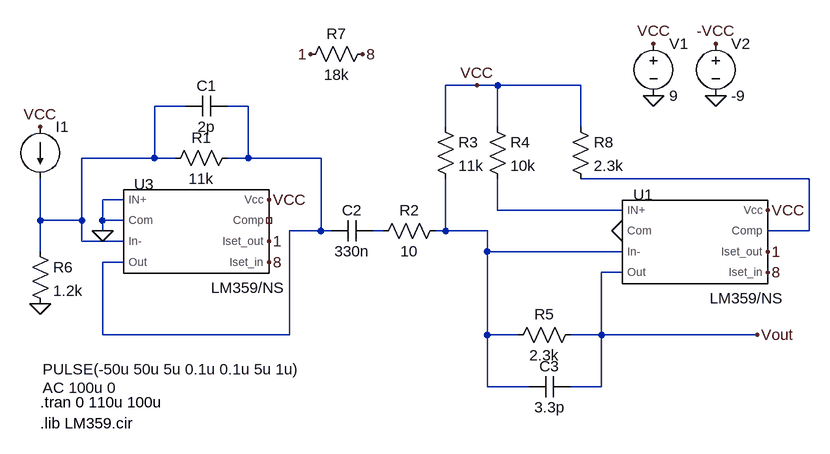
[diagram p0: schematic RX.asc]
RX.asc, the LTspice schematic file:
Version 4
SHEET 1 1124 680
WIRE 432 -128 384 -128
WIRE 464 -128 432 -128
WIRE 592 -128 464 -128
WIRE -16 -96 -64 -96
WIRE 80 -96 48 -96
WIRE 384 -64 384 -128
WIRE 464 -64 464 -128
WIRE 592 -64 592 -128
WIRE -64 -16 -64 -96
WIRE -64 -16 -176 -16
WIRE -32 -16 -64 -16
WIRE 80 -16 80 -96
WIRE 80 -16 48 -16
WIRE 192 -16 80 -16
WIRE 944 16 592 16
WIRE -112 48 -144 48
WIRE 464 64 464 16
WIRE 656 64 464 64
WIRE -240 80 -240 16
WIRE -176 80 -176 -16
WIRE -176 80 -240 80
WIRE -144 80 -144 48
WIRE -112 80 -144 80
WIRE -144 96 -144 80
WIRE 192 96 192 -16
WIRE 192 96 144 96
WIRE 208 96 192 96
WIRE 288 96 272 96
WIRE 384 96 384 16
WIRE 384 96 368 96
WIRE 448 96 384 96
WIRE 944 96 944 16
WIRE 944 96 880 96
WIRE -176 112 -176 80
WIRE -112 112 -176 112
WIRE -240 128 -240 80
WIRE 448 128 448 96
WIRE 656 128 448 128
WIRE -112 144 -144 144
WIRE 656 160 624 160
WIRE -144 256 -144 144
WIRE 144 256 144 96
WIRE 144 256 -144 256
WIRE 448 256 448 128
WIRE 496 256 448 256
WIRE 624 256 624 160
WIRE 624 256 576 256
WIRE 864 256 624 256
WIRE 448 336 448 256
WIRE 512 336 448 336
WIRE 624 336 624 256
WIRE 624 336 576 336
FLAG -240 208 0
FLAG -144 96 0
FLAG 704 -112 0
FLAG 800 -112 0
FLAG 704 -192 VCC
FLAG 800 -192 -VCC
FLAG 432 -128 VCC
FLAG -240 -64 VCC
FLAG 176 -176 1
FLAG 256 -176 8
FLAG 112 112 1
FLAG 112 144 8
FLAG 112 48 VCC
FLAG 880 64 VCC
FLAG 880 128 1
FLAG 880 160 8
FLAG 656 96 0
FLAG 864 256 Vout
SYMBOL res 64 -32 R90
WINDOW 0 0 56 VBottom 2
WINDOW 3 32 56 VTop 2
SYMATTR InstName R1
SYMATTR Value 11k
SYMBOL cap 48 -112 R90
WINDOW 0 0 32 VBottom 2
WINDOW 3 32 32 VTop 2
SYMATTR InstName C1
SYMATTR Value 2p
SYMBOL cap 272 80 R90
WINDOW 0 0 32 VBottom 2
WINDOW 3 32 32 VTop 2
SYMATTR InstName C2
SYMATTR Value 330n
SYMBOL res 384 80 R90
WINDOW 0 0 56 VBottom 2
WINDOW 3 32 56 VTop 2
SYMATTR InstName R2
SYMATTR Value 10
SYMBOL res 368 -80 R0
SYMATTR InstName R3
SYMATTR Value 11k
SYMBOL res 448 -80 R0
SYMATTR InstName R4
SYMATTR Value 10k
SYMBOL res 592 240 R90
WINDOW 0 0 56 VBottom 2
WINDOW 3 32 56 VTop 2
SYMATTR InstName R5
SYMATTR Value 2.3k
SYMBOL cap 576 320 R90
WINDOW 0 0 32 VBottom 2
WINDOW 3 32 32 VTop 2
SYMATTR InstName C3
SYMATTR Value 3.3p
SYMBOL res -256 112 R0
SYMATTR InstName R6
SYMATTR Value 1.2k
SYMBOL voltage 704 -208 R0
SYMATTR InstName V1
SYMATTR Value 9
SYMBOL voltage 800 -208 R0
SYMATTR InstName V2
SYMATTR Value -9
SYMBOL current -240 -64 R0
WINDOW 123 4 401 Left 2
WINDOW 39 0 0 Left 0
WINDOW 3 4 373 Left 2
SYMATTR Value2 AC 100u 0
SYMATTR Value PULSE(-50u 50u 5u 0.1u 0.1u 5u 1u)
SYMATTR InstName I1
SYMBOL res 272 -192 R90
WINDOW 0 0 56 VBottom 2
WINDOW 3 32 56 VTop 2
SYMATTR InstName R7
SYMATTR Value 18k
SYMBOL LM359_NS -80 128 R0
SYMATTR InstName U3
SYMBOL LM359_NS 688 144 R0
SYMATTR InstName U1
SYMBOL Res 576 -80 R0
SYMATTR InstName R8
SYMATTR Value 2.3k
TEXT -240 360 Left 2 !.tran 0 110u 100u
TEXT -240 392 Left 2 !.lib LM359.cir

The netlist it stands for:
* RX.asc
R1 N002 N001 11k
C1 N002 N001 2p
C2 N005 N002 330n
R2 N006 N005 10
R3 VCC N006 11k
R4 VCC N004 10k
R5 Vout N006 2.3k
C3 Vout N006 3.3p
R6 N001 0 1.2k
V1 VCC 0 9
V2 -VCC 0 -9
I1 VCC N001 PULSE(-50u 50u 5u 0.1u 0.1u 5u 1u) AC 100u 0
R7 8 1 18k
XU3 0 0 N001 N002 VCC NC_01 1 8 LM359/NS  ; pins IN+ Com In- Out Vcc Comp Iset_out Iset_in
XU1 N004 0 N006 Vout VCC N003 1 8 LM359/NS  ; pins IN+ Com In- Out Vcc Comp Iset_out Iset_in
R8 VCC N003 2.3k
.tran 0 110u 100u
.lib LM359.cir
.lib C:\Users\sel\Documents\LTspice\LM359.cir
.backanno
.end